# EAGLE board Balanbot-v2.0 (EAGLE 6.6.0)
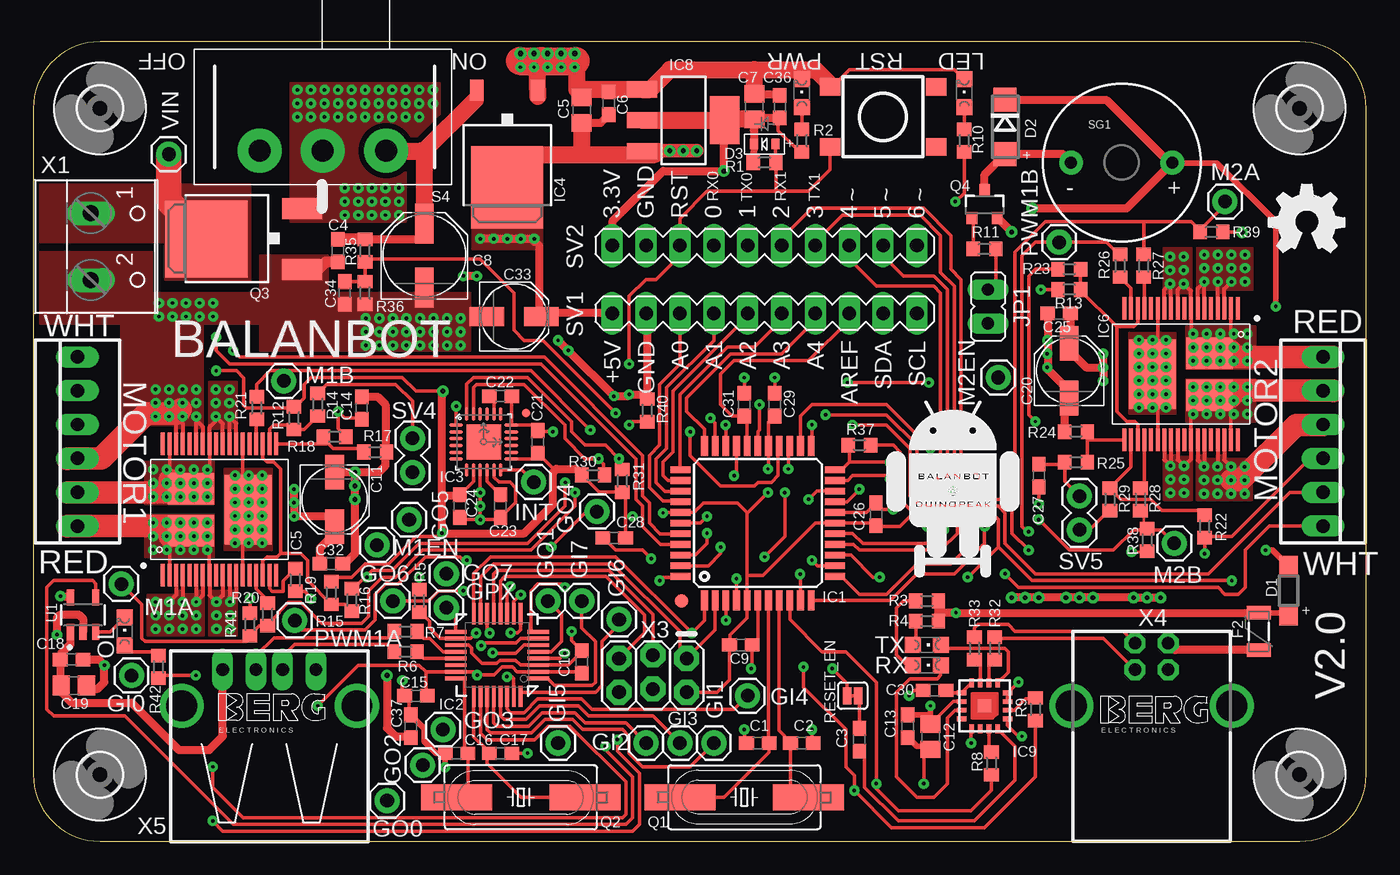
[diagram p2: board, top side]
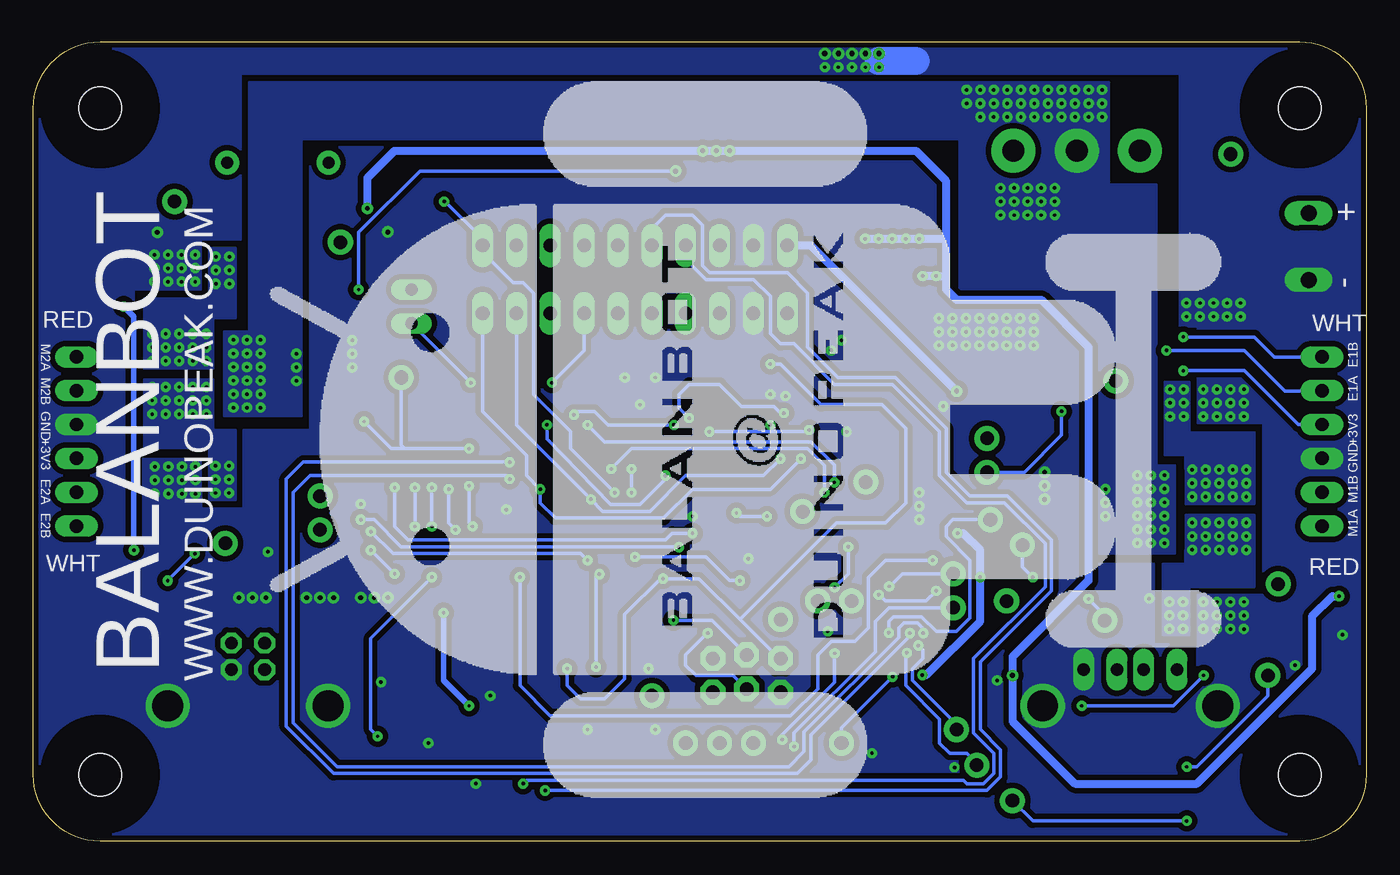
[diagram p3: board, bottom side, seen from below]

Size 100 x 60 mm. Coordinates in mm from the lower left corner, seen from the top.
Outline: 5,0 95,0 arc90 100,5 100,55 arc90 95,60 5,60 arc90 0,55 0,5 arc90 5,0
Copper layers (1*16): Top 0.035mm / dielectric 1.5mm / Bottom 0.035mm
Design rules "Sparkfun *": minimum track width 8mil, minimum drill 8mil, track to track 8mil, track to pad 8mil, pad to pad 8mil, via to via 8mil, smd to smd 8mil, copper to edge 10mil, drill to drill 8mil, minimum pad ring 12mil, minimum via ring 10mil, stop-mask expansion 4mil, vias tented up to drill 25mil, thermal gap 10mil

## Footprints (pad centres in the part's own frame; a part is rotated, then mirrored left to right if it is on the bottom)
C0603 = smd 1.1 x 1: 1 -0.85,0; 2 0.85,0
C0805 = smd 1.3 x 1.5: 1 -0.95,0; 2 0.95,0
PANASONIC_D = smd 3 x 1.4: + 2.4,0; - -2.4,0
PANASONIC_C = smd 2.6 x 1.4: + 2.05,0; - -2.05,0
SOD123 = smd 1.4 x 1.4: A 1.9,0; C -1.9,0
DO214AC = smd 1.8 x 1.7: A 2.05,0; C -2.05,0
SOD-523 = smd 0.8 x 0.6: A 0,-0.8; K 0,0.8
PTC-1206 = smd 1 x 1.8: 1 -1.4,0; 2 1.4,0
1X01 = drill 1.016 pad 1.88: 1 0,0
3,2 = hole 3.2: 0,0
TQFP44 = smd 1.5 x 0.5: 1 -5.8,4; 2 -5.8,3.2; 3 -5.8,2.4; 4 -5.8,1.6; 5 -5.8,0.8; 6 -5.8,0; 7 -5.8,-0.8; 8 -5.8,-1.6; 9 -5.8,-2.4; 10 -5.8,-3.2; 11 -5.8,-4; 23 5.8,-4; 24 5.8,-3.2; 25 5.8,-2.4; 26 5.8,-1.6; 27 5.8,-0.8; 28 5.8,0; 29 5.8,0.8; 30 5.8,1.6; 31 5.8,2.4; 32 5.8,3.2; 33 5.8,4 | smd 0.5 x 1.5: 12 -4,-5.8; 13 -3.2,-5.8; 14 -2.4,-5.8; 15 -1.6,-5.8; 16 -0.8,-5.8; 17 0,-5.8; 18 0.8,-5.8; 19 1.6,-5.8; 20 2.4,-5.8; 21 3.2,-5.8; 22 4,-5.8; 34 4,5.8; 35 3.2,5.8; 36 2.4,5.8; 37 1.6,5.8; 38 0.8,5.8; 39 0,5.8; 40 -0.8,5.8; 41 -1.6,5.8; 42 -2.4,5.8; 43 -3.2,5.8; 44 -4,5.8
TQFP32_8MIL = smd 0.294 x 1.6: 1 -1.75,-3.1; 2 -1.25,-3.1; 3 -0.75,-3.1; 4 -0.25,-3.1; 5 0.25,-3.1; 6 0.75,-3.1; 7 1.25,-3.1; 8 1.75,-3.1; 17 1.75,3.1; 18 1.25,3.1; 19 0.75,3.1; 20 0.25,3.1; 21 -0.25,3.1; 22 -0.75,3.1; 23 -1.25,3.1; 24 -1.75,3.1 | smd 1.6 x 0.294: 9 3.1,-1.75; 10 3.1,-1.25; 11 3.1,-0.75; 12 3.1,-0.25; 13 3.1,0.25; 14 3.1,0.75; 15 3.1,1.25; 16 3.1,1.75; 25 -3.1,1.75; 26 -3.1,1.25; 27 -3.1,0.75; 28 -3.1,0.25; 29 -3.1,-0.25; 30 -3.1,-0.75; 31 -3.1,-1.25; 32 -3.1,-1.75
TESTING_QFN-24-4MM2 = smd 1.016 x 0.254: 1 -2.066,1.257; 2 -2.066,0.75; 3 -2.066,0.247; 4 -2.066,-0.287; 5 -2.066,-0.792; 6 -2.066,-1.297; 13 2.086,-1.297; 14 2.086,-0.792; 15 2.086,-0.287; 16 2.086,0.247; 17 2.086,0.75; 18 2.086,1.257 | smd 0.254 x 1.016: 7 -1.267,-2.122; 8 -0.762,-2.122; 9 -0.258,-2.122; 10 0.278,-2.122; 11 0.78,-2.122; 12 1.287,-2.122; 19 1.287,2.082; 20 0.78,2.082; 21 0.278,2.082; 22 -0.258,2.082; 23 -0.762,2.082; 24 -1.267,2.082 | smd 2.616 x 2.616: P$1 0.02,-0.01
DPACK = smd 1 x 1.6: 1 -2.28,-4.8; 3 2.28,-4.8 | smd 5.4 x 6.2: 2 0,2.5
POWERSSO-36 = smd 1.7 x 0.3: 1 -4.933,4.25; 2 -4.933,3.75; 3 -4.933,3.25; 4 -4.933,2.75; 5 -4.933,2.25; 6 -4.933,1.75; 7 -4.933,1.25; 8 -4.933,0.75; 9 -4.933,0.25; 10 -4.933,-0.25; 11 -4.933,-0.75; 12 -4.933,-1.25; 13 -4.933,-1.75; 14 -4.933,-2.25; 15 -4.933,-2.75; 16 -4.933,-3.25; 17 -4.933,-3.75; 18 -4.933,-4.25; 19 4.933,-4.25; 20 4.933,-3.75; 21 4.933,-3.25; 22 4.933,-2.75; 23 4.933,-2.25; 24 4.933,-1.75; 25 4.933,-1.25; 26 4.933,-0.75; 27 4.933,-0.25; 28 4.933,0.25; 29 4.933,0.75; 30 4.933,1.25; 31 4.933,1.75; 32 4.933,2.25; 33 4.933,2.75; 34 4.933,3.25; 35 4.933,3.75; 36 4.933,4.25 | smd 5.2 x 3.5: S1 0,-2.15 | smd 2.35 x 3.5: S2 -1.575,2.15; S3 1.575,2.15
SOT223 = smd 1.219 x 2.235: 1 -2.311,-3.099; 2 0,-3.099; 3 2.311,-3.099 | smd 3.6 x 2.2: 4 0,3.099
QFN16 = smd 0.7 x 0.35: 1 -1.725,0.975; 2 -1.725,0.325; 3 -1.725,-0.325; 4 -1.725,-0.975; 9 1.725,-0.975; 10 1.725,-0.325; 11 1.725,0.325; 12 1.725,0.975 | smd 0.35 x 0.7: 5 -0.975,-1.725; 6 -0.325,-1.725; 7 0.325,-1.725; 8 0.975,-1.725; 13 0.975,1.725; 14 0.325,1.725; 15 -0.325,1.725; 16 -0.975,1.725 | smd 1 x 1: TAB 0,0
JP1 = drill 0.914 long: 1 0,-1.27; 2 0,1.27
MICRO-FIDUCIAL = smd 0.635 x 0.635: 1 0,0
FIDUCIAL-1X2 = smd 1 x 1: 1 0,0
CHIPLED_0805 = smd 1.2 x 1.2: A 0,-1.05; C 0,1.05
22-23-2061 = drill 1 long: 1 -6.35,0; 2 -3.81,0; 3 -1.27,0; 4 1.27,0; 5 3.81,0; 6 6.35,0
HC49UP = smd 5.334 x 1.93: 1 -4.826,0; 2 4.826,0
DPAK = smd 1.6 x 3: 1 -2.285,-7.18; 3 2.285,-7.18 | smd 5.8 x 6.2: 4 0,0
SOT23-3 = smd 0.8 x 0.9: 1 -0.95,-1; 2 0.95,-1; 3 0,1.1
R0603 = smd 1 x 1.1: 1 -0.85,0; 2 0.85,0
SJ_2S = smd 0.635 x 1.27: 1 -0.412,0; 2 0.412,0
TACTILE_SWITCH_TALL = smd 1.55 x 1.3: A1 -3.975,-2.25; A2 3.975,-2.25; B1 -3.975,2.25; B2 3.975,2.25
SWITCH-SPDT = drill 1.651 pad 3.302: 1 -2.54,-4.623; 2 -2.54,0.127; 3 -2.54,4.877
BUZZER-12MM = drill 0.9 pad 1.778: + 3.8,0; - -3.8,0
MA10-1 = drill 1.016 long: 1 -10.16,0; 2 -7.62,0; 3 -5.08,0; 4 -2.54,0; 5 0,0; 6 2.54,0; 7 5.08,0; 8 7.62,0; 9 10.16,0; 10 12.7,0
1X02 = drill 1.016 pad 1.88: 1 0,0; 2 2.54,0
SOT23-5 = smd 0.55 x 1.2: 1 -0.95,-1.3; 2 0,-1.3; 3 0.95,-1.3; 4 0.95,1.3; 5 -0.95,1.3
W237-102 = drill 1.194 long: 1 -2.5,-1.27; 2 2.5,-1.27
2X3_LOCK = drill 1.016 pad 1.88 octagon: 1 0,0; 2 0,2.54; 3 2.54,-0.254; 4 2.54,2.286; 5 5.08,0; 6 5.08,2.54
PN61729-S = drill 0.95 octagon: 1 1.25,4.71; 2 -1.25,4.71; 3 -1.25,2.71; 4 1.25,2.71 | drill 2.3 pad 2.9: S1 -6.02,0; S2 6.02,0
PN87520-S = drill 0.95 long: 1 -3.5,2.71; 2 -1,2.71; 3 1,2.71; 4 3.5,2.71 | drill 2.3 pad 2.9: S1 -6.57,0; S2 6.57,0

## Placement (x,y rotation side)
C1  18pF  [C0603]  54.36,7.37 0 top
C2  18pF  [C0603]  57.66,7.37 0 top
C3  100nF  [C0603]  61.98,7.62 90 top
C4  100nF/16V  [C0603]  22.86,44.32 90 top
C5  10uF  [C0805]  41.15,54.86 90 top
C6  100nF  [C0603]  43.18,55.37 270 top
C7  10uF  [C0805]  54.1,55.12 90 top
C8  100uF/16V  [PANASONIC_D]  29.34,43.94 90 top
C9  100nF  [C0603]  53.09,14.73 180 top
C10  100nF  [C0603]  41.15,13.46 90 top
C11  47uF/16V  [PANASONIC_C]  22.61,25.65 270 top
C12  4.7uF  [C0805]  67.31,7.85 270 top
C13  100nF  [C0603]  65.61,8.64 90 top
C14  33nF  [C0603]  24.64,32.51 90 top
C15  100nF  [C0603]  28.7,10.92 180 top
C16  18pF  [C0603]  31.75,6.6 0 top
C17  18pF  [C0603]  35.05,6.6 180 top
C18  100nF  [C0603]  2.87,13.64 0 top
C19  4.7uF  [C0805]  3.05,11.68 0 top
C20  47uF/16V  [PANASONIC_C]  77.72,35.31 90 top
C21  100nF  [C0603]  37.85,29.97 90 top
C22  2.2nF  [C0603]  35.05,33.4 0 top
C23  100nF  [C0603]  35.05,25.15 90 top
C24  10nF  [C0603]  32,25.15 90 top
C25  100nF  [C0603]  76.96,39.62 180 top
C26  100nF  [C0603]  63.22,24.54 270 top
C27  33nF  [C0603]  75.44,27.43 270 top
C28  100nF  [C0603]  43.59,22.76 0 top
C29  100nF  [C0603]  55.63,32.77 270 top
C30  100nF  [C0603]  67.61,11.33 0 top
C31  100nF  [C0603]  53.34,32.77 270 top
C32  100nF  [C0603]  22.35,20.83 0 top
C33  47uF/16V  [PANASONIC_C]  36.07,39.37 0 top
C34  100nF  [C0603]  23.37,41.15 90 top
C36  100nF  [C0603]  56.01,55.12 270 top
C37  100nF  [C0603]  28.32,8.64 90 top
D1  PMEG2010-ER  [SOD123]  94.18,18.8 270 top
D2  S1M-13-F  [DO214AC]  72.9,53.59 270 top
D3  1N4148  [SOD-523]  54.86,52.32 90 top
F2  PTC_500mA  [PTC-1206]  91.95,15.75 90 top
GI0  M01PTH  [1X01]  7.37,12.45 0 top
GI1  M01PTH  [1X01]  51.05,7.37 90 top
GI2  M01PTH  [1X01]  45.97,7.37 90 top
GI3  M01PTH  [1X01]  48.51,7.37 90 top
GI4  M01PTH  [1X01]  53.59,10.92 90 top
GI5  M01PTH  [1X01]  39.37,7.37 90 top
GI6  M01PTH  [1X01]  43.94,16.64 90 top
GI7  M01PTH  [1X01]  41.15,18.03 90 top
GO0  M01PTH  [1X01]  26.54,3.05 0 top
GO1  M01PTH  [1X01]  38.61,18.03 90 top
GO2  M01PTH  [1X01]  29.21,5.71 90 top
GO3  M01PTH  [1X01]  30.73,8.38 90 top
GO4  M01PTH  [1X01]  42.29,24.74 90 top
GO5  M01PTH  [1X01]  28.19,24.13 90 top
GO6  M01PTH  [1X01]  26.97,18.03 90 top
GO7  M01PTH  [1X01]  30.99,20.07 90 top
GPX  M01PTH  [1X01]  30.99,17.53 0 top
H1  MOUNT-HOLE3.2  [3,2]  5,5 0 top
H2  MOUNT-HOLE3.2  [3,2]  95,5 0 top
H3  MOUNT-HOLE3.2  [3,2]  5,55 0 top
H4  MOUNT-HOLE3.2  [3,2]  95,55 0 top
IC1  ATMEGA1284PA  [TQFP44]  54.36,23.88 90 top
IC2  MAX3421E  [TQFP32_8MIL]  34.8,13.97 90 top
IC3  MPU-6050  [TESTING_QFN-24-4MM2]  33.78,29.97 0 top
IC4  MC33269D-5.0  [DPACK]  35.56,51.56 180 top
IC5  VNH5180ATR-E  [POWERSSO-36]  13.97,24.89 90 top
IC6  VNH5180ATR-E  [POWERSSO-36]  86.11,35.05 270 top
IC8  LD1117-3V3  [SOT223]  48.77,54.1 270 top
IC9  FT230XQ  [QFN16]  71.37,10.16 180 top
INT  M01PTH  [1X01]  37.54,26.95 0 top
JP1  [JP1]  71.63,40.13 0 top
JP2  FIDUCIALUFIDUCIAL  [MICRO-FIDUCIAL]  36.96,32.13 0 top
JP3  FIDUCIAL1X2  [FIDUCIAL-1X2]  48.64,18.03 0 top
LED  Yellow  [CHIPLED_0805]  69.85,56.13 0 top
LOGO2  OSHW_LOGO_FILLX0200-NT  [OSHW_FILLX200_NOTEXT]  92.71,44.2 0 top
M1A  M01PTH  [1X01]  6.6,19.3 0 top
M1B  M01PTH  [1X01]  18.8,34.54 0 top
M1EN  M01PTH  [1X01]  25.78,22.23 0 top
M2A  M01PTH  [1X01]  89.41,48.01 0 top
M2B  M01PTH  [1X01]  85.6,22.35 270 top
M2EN  M01PTH  [1X01]  72.39,34.8 0 top
MOTOR1  1744037-6(SEE-PICTURE)  [22-23-2061]  3.3,30 90 top
MOTOR2  1744037-6(SEE-PICTURE)  [22-23-2061]  96.77,30 270 top
OL  Red  [CHIPLED_0805]  6.86,15.75 0 top
PWM1A  M01PTH  [1X01]  19.61,16.56 0 top
PWM1B  M01PTH  [1X01]  76.96,44.96 0 top
PWR  Green  [CHIPLED_0805]  57.66,56.13 0 top
Q1  10MHz  [HC49UP]  53.34,3.3 180 top
Q2  12MHz  [HC49UP]  36.58,3.3 0 top
Q3  DMP3025  [DPAK]  12.98,45.19 90 top
Q4  [SOT23-3]  71.37,47.75 0 top
R1  10K  [R0603]  54.86,50.93 180 top
R2  270R  [R0603]  57.66,52.58 270 top
R3  560R  [R0603]  67.06,18.03 0 top
R4  560R  [R0603]  67.06,16.51 0 top
R5  2.2K  [R0603]  28.96,18.03 90 top
R6  33/1%  [R0603]  27.94,14.22 0 top
R7  33/1%  [R0603]  27.94,15.75 0 top
R8  1K  [R0603]  71.88,5.84 90 top
R9  1K  [R0603]  75.18,9.91 90 top
R10  1K  [R0603]  69.85,52.58 270 top
R11  1K  [R0603]  71.37,44.45 180 top
R12  10K  [R0603]  19.56,31.75 90 top
R13  10K  [R0603]  77.72,41.4 180 top
R14  1K  [R0603]  21.34,32.77 270 top
R15  10K  [R0603]  22.35,18.62 90 top
R16  1K  [R0603]  23.9,18.11 90 top
R17  1K5  [R0603]  25.65,29.21 180 top
R18  10K  [R0603]  22.61,30.35 180 top
R19  1K  [R0603]  19.66,19.61 270 top
R20  1K  [R0603]  17.58,17.02 270 top
R21  1K  [R0603]  16.76,32.51 90 top
R22  10K  [R0603]  87.88,23.62 270 top
R23  1K  [R0603]  77.72,42.93 180 top
R24  1K5  [R0603]  78.23,30.73 0 top
R25  10K  [R0603]  78.23,28.45 0 top
R26  1K  [R0603]  81.53,43.18 90 top
R27  1K  [R0603]  83.31,43.18 90 top
R28  1K  [R0603]  83.06,25.65 270 top
R29  1K  [R0603]  80.77,25.65 90 top
R30  10K  [R0603]  42.01,27.48 180 top
R31  10K  [R0603]  44.2,27.05 270 top
R32  27  [R0603]  72.14,14.48 270 top
R33  27  [R0603]  70.61,14.48 270 top
R35  47K  [R0603]  24.89,44.32 90 top
R36  12K  [R0603]  24.89,41.15 90 top
R37  10K  [R0603]  61.98,29.72 180 top
R38  10K  [R0603]  83.57,22.61 90 top
R39  10K  [R0603]  88.39,45.72 180 top
R40  10K  [R0603]  46.05,32.33 270 top
R41  10K  [R0603]  16.26,16.26 270 top
R42  270R  [R0603]  9.4,13.08 270 top
RESET_EN  SOLDERJUMPERNC  [SJ_2S]  61.47,10.92 180 top
RX  YELLOW  [CHIPLED_0805]  67.06,13.21 270 top
S1  DTSM-62K-S-V-T/R(SN431)  [TACTILE_SWITCH_TALL]  63.75,54.36 180 top
S4  [SWITCH-SPDT]  21.84,54.36 90 top
SG1  BUZZERPTH  [BUZZER-12MM]  81.66,50.93 0 top
SV1  [MA10-1]  53.59,39.62 0 top
SV2  [MA10-1]  53.59,44.7 0 top
SV3  VIN  [1X01]  10.16,51.56 0 top
SV4  [1X02]  28.45,27.69 90 top
SV5  [1X02]  78.49,25.91 270 top
TX  YELLOW  [CHIPLED_0805]  67.06,14.73 270 top
U1  NCP380HSN05AAT1G  [SOT23-5]  3.73,16.99 0 top
U$2  [DUINOPEAK-ANDROID-LOGO-0.65]  64.01,19.81 0 top
U$3  [DUINOPEAK-ANDROID-LOGO-3.5]  10.92,3.3 90 bottom
X1  [W237-102]  5.59,44.62 270 top
X3  AVR_SPI_PRG_62X3_LOCK  [2X3_LOCK]  49.02,13.72 180 top
X4  PN61729-S  [PN61729-S]  83.9,10.16 0 top
X5  PN87520-S  [PN87520-S]  17.7,10.16 0 top

## Tracks (layer width: path | path; a pad name or v marks a point on that pad's centre or on a via)
+3V3  (via drill 0.25, 0.36)
  Top 0.254: 52.25,14.73 52.27,14.76 52.27,15.47 53.56,16.75 IC1.5 53.56,19.95 | 52.25,14.73 52.32,14.73 52.32,14.99 | 52.25,14.73 C9.2 52.24,12.1 51.31,11.18 X3.2 | C29.2 55.16,31.45 IC1.27 55.16,27.98 v55.12,27.94 | IC3.13 37.4,28.68 C21.1 39.12,27.85 39.24,27.94 | IC3.8 33.02,27 32.03,26.01 32.03,25.93 32,25.91 C24.2 | v13.72,35.31 15.24,35.31 15.8,34.75 15.8,32.72 16,32.51 19.47,32.51 R12.2 19.65,32.6 | MOTOR2.4 95.79,28.73 89.92,22.86 87.88,22.86 R22.2 v87.88,21.59 | IC2.23 | 53.56,19.95 53.56,24.65 | 53.56,24.65 53.58,24.65 | 53.58,24.65 53.59,24.64 v55.12,26.16 | 53.56,24.65 53.56,24.68 | v75.59,41.4 R13.2 | 72.39,22.1 72.39,24.13 71.88,24.64 66.04,24.64 | 66.04,24.64 65.02,23.62 63.16,23.62 | 53.56,19.95 54.75,19.95 58.67,23.88 IC1.17 63.03,23.88 C26.2 63.16,23.62 | 30.66,33.78 28.7,33.78 27.69,34.8 20.83,34.8 20.32,34.29 20.32,33.27 19.65,32.6 | 30.66,33.78 30.66,33.71 30.65,33.7 | R2.2 57.24,51.73 57.24,51.98 55.88,53.34 55.88,54.36 | 53.56,24.68 52.83,25.4 50.29,25.4 49.57,24.68 IC1.38 47.28,24.68 v47.24,24.64 | 53.56,24.68 53.58,24.65 | IC9.1 73.1,8.69 73.91,7.87 v74.17,7.87 | v70.1,19.81 72.39,22.1 | R37.1 64.52,29.72 65.02,29.21 65.02,25.65 66.04,24.64 | C10.1 41.04,12.72 IC2.2 36.3,12.72 35.94,13.08 35.18,13.08 34.57,12.47 v33.3,12.47 33.05,12.72 IC2.23 | R5.2 v28.96,19.81 | v21.34,10.16 24.38,13.21 28.96,13.21 29.46,12.7 | 29.46,12.7 31.5,12.7 31.52,12.72 IC2.23 | 29.46,12.7 29.46,11.34 29.55,11.25 C15.1 | 62.9,23.62 63.16,23.62 | v30.73,33.78 30.66,33.78 | 19.65,32.6 19.56,32.51 | R15.2 22.34,19.47 22.3,19.51 22.61,19.81 23.88,19.81 24.89,20.83 26.67,20.83 28.7,22.86 30.48,22.86 30.73,23.11
  Top 0.254: v12.19,12.45 9.4,12.45 R42.2 | 54.1,54.1 54.1,54.05 54.06,54.01 | C7.1 54.1,54.1 | 54.1,54.1 54.29,54.1 54.46,54.27 | C28.2 44.44,24.38 | 44.44,24.38 44.44,25.92 44.2,26.16 R31.2 42.44,26.2 R30.2 | v44.96,24.38 44.44,24.38 | 72.39,22.1 74.93,19.56 v89.92,19.56
  Top 0.406: 56.13,54.1 56.13,54.27 C36.2 56.01,54.36 55.88,54.36
  Top 0.508: D3.K 54.03,51.31 54.03,50.66 R1.2 | 54.01,53.34 54.06,52.83 54.06,53.59 | IC8.4 52.07,54.1 52.07,54.36
  Top 0.61: 51.82,54.15 v51.82,50.29 47.24,50.29 43.43,46.48 SV2.1 | 30.65,25.91 v30.65,23.12 v30.66,23.11 | v30.66,23.11 30.73,23.11 36.83,23.11 38.99,25.27 38.99,27.69 39.24,27.94 40.7,27.94 R30.2 | 32,25.91 30.65,25.91 | v30.66,23.11 30.66,23.04 | 30.65,25.91 30.65,33.7 | C36.2 54.46,54.27 | 52.26,54.17 52.07,54.36 | 54.01,54.01 54.06,54.01 54.06,53.59 D3.K
  Top 1.27: IC8.2 IC8.4 51.82,54.15 | 51.82,54.15 | C7.1 52.26,54.17
  Bottom 0.254: MOTOR1.4 5.11,31.27 9.14,35.31 v13.72,35.31 | v55.12,27.94 v55.12,26.16 | v51.82,50.29 70.99,50.29 75.59,45.69 v75.59,41.4 | v74.17,7.87 74.68,8.38 74.68,15.24 v70.1,19.81 | v21.34,10.16 14.48,10.16 v12.19,12.45 | v44.96,24.38 46.99,24.38 v47.24,24.64 | v87.88,21.59 v89.92,19.56
  Bottom 0.61: v30.73,33.78 41.66,44.7 SV2.1 | v30.66,23.11 30.23,23.11 28.96,21.84 v28.96,19.81 28.96,16.51 32.99,12.47 v33.3,12.47
+5V  (via drill 0.25, 0.36)
  Top 0.254: 2.69,18.39 U1.5 | U1.5 | U1.5
  Top 0.406: v93.22,40.13 93.22,46.48 88.8,50.9 85.46,50.9 SG1.+ | 46.63,51.54 46,51.54 45.72,51.82 | IC8.3 45.24,51.79 45.21,51.82 | 37.95,44.65 37.95,44.86 v37.59,45.21 | D1.C 94.11,20.7 92.96,21.84 v92.46,21.84
  Top 0.61: v33.27,42.42 v32.26,42.42 | C5.1 42.57,53.91 C6.2 | v33.53,45.21 v34.54,45.21 v35.56,45.21 v36.58,45.21 v37.59,45.21 37.59,44.98 | v2.03,18.39 2.69,18.39 | 37.95,44.65 37.95,39.27 37.86,39.27 C33.+ 37.85,39.37 37.85,39.62 SV1.1 | D2.C 80.5,55.64 85.22,50.93 | 85.22,50.93 85.16,50.93 | v74.93,47.5 82.04,47.5 85.34,50.8 85.34,50.81 SG1.+ 85.22,50.93 | v26.54,12.45 26.54,8.51 27.18,7.87 28.23,7.87 C37.1
  Top 1.016: v49.78,51.82 45.72,51.82 45.21,51.82 44.96,51.82
  Top 1.27: 35.31,51.03 35.74,51.46 35.61,51.46 35.53,51.54 40.89,51.54 | 40.89,51.54 46.63,51.54 46.86,51.77 | C5.1 41.15,51.79 40.89,51.54
  Bottom 0.406: v93.22,40.13 92.46,39.37 v92.46,21.84
  Bottom 0.61: v74.93,47.5 74.93,49.78 72.9,51.82 v49.78,51.82 v48.77,51.82 v47.75,51.82 33.78,51.82 31.5,49.53 31.5,45.21 | 31.5,42.42 31.5,41.4 30.73,40.64 24.38,40.64 20.83,37.08 20.83,19.56 26.54,13.84 v26.54,12.45 26.54,9.02 21.84,4.32 12.7,4.32 4.06,12.95 4.06,16.86 2.54,18.39 v2.04,18.39 v2.03,18.39 | 31.5,42.42 31.5,45.21 | 31.5,42.42 v32.26,42.42 v33.27,42.42 | v37.59,45.21 31.5,45.21
  pour Top (no thermals): 32.97,46.74 38.15,46.74 38.15,44.45 32.97,44.45
A0
  Top 0.254: SV1.3 48.51,35.81 46.99,34.29 46.99,29.72 46.23,28.96 46.23,26.54 47.24,25.53 48.51,25.53 IC1.37
A1
  Top 0.254: IC1.36 48.54,26.26 47.4,26.26 46.74,26.92 46.74,28.7 47.5,29.46 47.5,34.04 51.05,37.59 SV1.4
A2
  Top 0.254: SV1.5 53.59,39.37 48.01,33.78 48.01,29.21 47.24,28.45 47.24,27.43 47.6,27.08 IC1.35
A3
  Top 0.254: IC1.34 48.56,27.9 48.51,27.94 48.51,33.53 52.07,37.08 54.1,37.08 56.13,39.12 SV1.6
A4/BUZZER  (via drill 0.25)
  Top 0.254: IC1.33 50.36,30.92 49.02,32.26 49.02,33.27 52.32,36.58 56.13,36.58 58.67,39.12 SV1.7 | v61.09,34.42 v67.18,34.42
  Bottom 0.254: SV1.7 58.67,36.83 v61.09,34.42 | v67.18,34.42 JP1.1
AREF
  Top 0.254: IC1.29 53.56,31.7 C31.2 52.41,31.92 51.56,32.77 51.56,35.05 52.58,36.07 58.17,36.07 61.21,39.12 SV1.8
EN1A  (via drill 0.25)
  Top 0.254: v14.99,36.83 15.49,36.32 38.35,36.32 45.72,28.96 45.72,25.91 46.23,25.4 46.23,23.88 47.03,23.08 IC1.40
  Bottom 0.254: v14.99,36.83 9.14,36.83 6.1,33.78 3.3,33.78 MOTOR1.5
EN1B  (via drill 0.25)
  Top 0.254: v13.72,37.85 13.72,36.83 14.73,35.81 38.1,35.81 45.21,28.7 45.21,25.65 45.72,25.15 45.72,23.62 47.07,22.28 IC1.41
  Bottom 0.254: MOTOR1.6 6.89,36.35 8.38,37.85 v13.72,37.85
EN2A  (via drill 0.25)
  Top 0.254: v59.44,32 64.01,32 66.29,29.72 66.29,26.16 66.8,25.65 72.9,25.65 73.41,25.15 73.41,23.11 v74.68,21.84 | IC1.31 51.96,30.87 v51.94,31.24 | v72.9,20.07 73.91,19.05 88.9,19.05 89.41,18.54 90.42,18.54 90.93,19.05 90.93,21.84 92.74,23.65 MOTOR2.6
  Bottom 0.254: v51.94,31.24 56.9,31.24 57.91,32.26 59.18,32.26 v59.44,32 | v74.68,21.84 v72.9,20.07
EN2B  (via drill 0.25)
  Top 0.254: IC1.30 52.76,27.61 v52.58,27.43 | v61.47,31.24 64.01,31.24 65.79,29.46 65.79,25.91 66.55,25.15 72.39,25.15 72.9,24.64 72.9,22.35 75.18,20.07 88.14,20.07 94.26,26.19 MOTOR2.5
  Bottom 0.254: v52.58,27.43 52.58,27.18 54.48,25.27 56.69,25.27 61.47,30.18 v61.47,31.24
GND  (via drill 0.25, 0.36, 0.4)
  Top 0.203: v82.4,21.72 83.53,21.72 R38.1
  Top 0.254: IC2.19 32.65,14.72 32.87,14.5 32.87,14.12 33.66,13.34 34.75,13.34 35,13.59 36.19,13.59 36.56,13.22 IC2.3 40.14,13.22 41.15,14.22 C10.2 | IC1.6 54.36,15.15 C9.1 53.94,13.04 v53.85,12.95 | v75.44,25.3 C27.2 | IC3.9 33.52,24.3 33.53,24.3 v33.53,24.13 | v33.53,24.13 32,24.13 C24.1 32,24.38 | v33.53,24.13 34.8,24.13 35.05,24.38 C23.1 36.19,25.44 36.19,26.52 35.76,26.95 34.93,26.95 34.56,27.31 IC3.11 | C31.1 v53.34,34.8 | C29.1 v55.63,34.8 | 59.94,24.64 59.98,24.68 IC1.18 62.52,24.68 63.22,25.37 C26.1 63.72,24.89 v64.52,24.89 | IC3.1 31.72,32.55 v31.72,32.64 | LED.C 69.82,57.18 69.09,57.91 61.21,57.91 59.94,56.64 59.81,56.64 S1.A2 | Q4.2 72.37,46.75 | IC1.39 50.04,23.88 v50.55,24.38 | v27.69,12.06 27.69,11.18 | 27.69,11.18 27.43,11.18 | IC9.3 IC9.4 73.11,11.14 v73.91,11.94 | C13.1 65.87,7.79 | C30.1 66.12,11.33 v65.71,10.92 | v66.8,4.32 66.8,6.39 C12.2 67.1,7.11 66.67,7.11 | v70.36,7.37 70.36,8.38 70.4,8.42 IC9.13 | Q3.1 21.36,42.9 | v90.7,45.69 89.27,45.69 R39.1 | v16.28,18.21 16.28,17.25 16.38,17.15 | 16.38,17.15 16.51,17.02 | 36.5,58.55 36.5,58.14 v36.55,58.09 | v40.61,58.09 40.56,58.09 40.51,58.04 | 28.19,11.18 28.19,10.92 | 28.19,10.92 28.19,9.99 28.32,9.87 C37.2 | C10.2 41.15,14.48 | C17.1 v37.08,6.6 | v40.39,15.75 40.39,15.07 C10.2 | IC1.28 54.36,30.73 54.48,30.86 v54.48,32.77 | v53.34,8.38 53.34,7.62 53.59,7.37 C1.1 53.34,7.37 | v58.42,8.38 58.42,7.45 C2.2 | C15.2 27.85,11.01 | 27.85,11.01 27.69,11.18 | v38.99,30.73 37.93,30.73 C21.2 37.44,31.23 IC3.18 35.87,33.75 35.9,33.53 C22.2 | R41.1 16.34,17.11 16.38,17.15 | 27.85,11.01 28.11,11.01 28.19,10.92 | 55.88,55.88 55.92,55.88 C36.1 | C28.1 42.9,22.63 43.69,21.84 45.72,21.84 v46.36,21.21
  Top 0.305: IC5.34 10.72,31.45 10.19,31.45 v10.19,31.88 | IC5.33 11.23,31.32 11.2,31.32 v11.2,31.88 | IC5.31 12.22,31.6 | IC5.30 12.73,31.09 12.22,31.6 | 12.22,31.6 v12.22,31.88 | IC5.3 10.72,18.49 v10.19,17.96 | IC5.4 11.22,17.98 v11.2,17.96 | IC5.6 v12.22,17.96 12.72,18.46 IC5.7 | IC6.34 89.36,28.63 v89.87,28.12 | IC6.33 v88.86,28.12 v88.85,28.12 | IC6.31 87.86,28.14 v87.83,28.12 87.36,28.59 IC6.30 | IC6.3 89.36,41.45 v89.89,41.99 | IC6.4 88.86,41.97 v88.87,41.99 | IC6.6 v87.86,41.98 v87.86,41.99 87.36,41.48 IC6.7
  Top 0.406: 43.14,56.26 C6.1 42.99,56.41 41.15,56.41 | 66.67,7.11 66.28,7.11 C13.1 | C37.2 29.34,8.47 29.34,7.49 30.23,6.6 C16.1 30.99,6.6 30.89,6.5 v30.89,5.54
  Top 0.61: C14.2 25.82,33.36 26.42,32.77 26.42,29.3 R17.1 26.42,29.12 26.42,28.19 25.93,27.7 24,27.7 | 82.8,18.29 v82.55,18.29 | v82.55,18.29 v79.5,18.29 | v79.5,18.29 v78.49,18.29 v77.47,18.29 | v82.55,18.29 v84.58,18.29 | v39.37,37.59 v40.13,36.83 v43.56,33.4 44.58,33.4 v44.7,33.53 46.05,33.53 | 72.37,46.75 v73.41,45.72 | v79.5,18.29 v75.44,18.29 v74.42,18.29 v73.41,18.29 | U1.2 3.73,16.69 3.4,17.02 2.03,17.02 1.78,16.76 v1.78,15.49 | 3.77,11.45 4.85,11.45 5.33,11.94 v5.33,13.21 4.9,13.64 C18.2 | C7.2 55.69,56.07 55.88,55.88 | PWR.C 57.66,57.91 | 3.72,11.45 3.77,11.45 | 3.77,11.45 C19.2 | C32.2 23.37,20.83 24.13,21.59 v24.13,25.65 v24.13,26.67 24.13,27.58 24,27.7 | SV1.2 46.05,39.62 46.05,33.53 | 46.05,33.53 R40.1 | C11.- 24,27.7 | R24.1 77.38,32.91 C20.- 77.47,33.51 77.47,34.04 76.11,35.39 76.11,35.56 | C25.2 76.11,35.56 | v76.07,35.56 76.11,35.56
  Top 0.813: C4.1 21.93,43.47 21.36,42.9
  Top 1.27: 41.15,56.41 IC8.1 46.25,56.41 47.75,57.91 54.1,57.91 | 41.15,56.41 40.79,56.41 40.79,57.76 40.51,58.04 40.39,58.17 | 54.1,57.91 57.66,57.91 58.67,57.91 59.94,56.64 | C7.2 54.1,57.91 | 38.1,58.55 37.84,58.29 IC4.1 37.84,55.89 37.85,55.88 | C5.2 41.15,56.41
  Top 1.676: 11.05,32.39 10.74,32.08 8.46,32.08 5.11,28.73 MOTOR1.3 2.57,28.73 2.54,28.7 | v89.87,27.1 90.6,27.1 94.74,31.24 96.77,31.24
  Top 2.083: 36.5,58.55 38.1,58.55 40.72,58.55
  Bottom 2.083: 33.78,58.55 36.58,58.55
  other vias: 10.19,16.94 10.19,15.93 11.2,16.94 11.2,15.93 12.22,15.93 12.22,16.94 12.22,32.89 11.2,32.89 10.19,32.89 12.22,33.91 11.2,33.91 10.19,33.91 30.02,37.21 30.02,38.23 31.04,38.23 29.01,37.21 31.04,37.21 32.05,38.23 32.05,37.21 25.96,38.23 25.96,37.21 26.97,37.21 27.99,37.21 27.99,38.23 26.97,38.23 24.94,37.21 24.94,38.23 87.83,27.1 87.83,26.09 88.85,26.09 89.87,26.09 88.85,27.1 89.89,43 89.89,44.02 88.87,43 88.87,44.02 87.86,43 90.88,28.12 90.88,27.1 90.88,26.09 90.91,44.02 90.91,43 90.91,41.99 9.17,33.91 9.17,32.89 9.17,31.88 9.17,17.96 9.17,16.94 9.17,15.93 11.46,40.39 10.44,39.37 10.44,40.39 12.47,39.37 11.46,39.37 12.47,40.39 33.53,25.15 33.53,26.16 38.58,58.09 38.58,59.11 36.55,59.11 37.57,59.11 83.57,18.29 87.86,44.02 24.94,39.24 25.96,39.24 26.97,39.24 27.99,39.24 30.02,39.24 31.04,39.24 32.05,39.24 39.6,59.11 40.61,59.11 13.49,40.39 13.49,39.37 9.42,39.37 9.42,40.39 37.57,58.09 39.6,58.09 29.01,38.23 24.13,27.69 76.07,37.59 76.07,36.58 29.01,39.24
  pour Top (no thermals): 10.67,31.01 10.67,31.24 6.6,31.24 6.6,39.37 12.7,39.37 12.7,31.01 12.17,31.01 12.17,31.24 11.28,31.24 11.28,31.01
  pour Top (no thermals): 12.78,18.77 12.78,15.44 8.59,15.44 8.59,18.49 10.67,18.49 10.67,18.77 11.28,18.77 11.28,18.54 12.17,18.54 12.17,18.77
  pour Top (no thermals): 0.51,44.2 8.89,44.2 8.89,41.15 32.77,41.15 32.77,36.83 17.02,36.83 17.02,38.86 0.53,38.86
  pour Top (no thermals): 89.41,28.93 89.41,28.7 91.41,28.7 91.41,25.6 87.3,25.6 87.3,28.93 87.91,28.93 87.91,28.7 88.8,28.7 88.8,28.93
  pour Top (no thermals): 87.33,41.17 87.33,44.5 91.47,44.5 91.47,41.4 89.41,41.4 89.41,41.17 88.82,41.17 88.82,41.4 87.91,41.4 87.91,41.17
  pour Bottom (isolate 0.406, no thermals): 35.56,60 100,60 100,0 0,0 0,60 35.05,60 35.05,57.58 13.97,57.58 13.97,38.61 12.65,38.61 12.65,31.37 7.72,31.34 7.72,18.49 12.65,18.49 12.7,2.51 87.22,2.51 87.45,28.7 92.46,28.7 92.46,41.4 87.43,41.4 87.43,45.16 84.43,45.16 84.43,57.58 35.56,57.58
  pour Bottom (isolate 0.406, no thermals): 32,52.07 79.25,52.07 79.25,30.86 84.2,30.86 84.2,24.97 87.63,24.97 87.63,2.29 12.45,2.29 12.45,14.78 15.93,14.78 15.93,20.83 21.34,20.83 21.34,36.83 24.64,40.13 30.99,40.13 32,41.15
  pour Top (no thermals): 17.02,40.64 17.02,43.94 22.1,43.94 22.1,40.64
GPIN0  (via drill 0.25)
  Top 0.254: v13.46,5.59 13.46,4.06 15.75,1.78 44.2,1.78 44.45,2.03 44.45,4.44 40.26,8.64 38.61,8.64 37.59,7.62 34.04,7.62 33.55,8.11 IC2.26
  Bottom 0.254: v13.46,5.59 12.7,5.59 7.37,10.92 GI0.1
GPIN1
  Top 0.254: IC2.27 34.05,8.37 34.29,8.13 37.39,8.13 38.4,9.14 40.46,9.14 41.22,8.38 44.2,8.38 44.7,7.87 44.7,6.6 45.72,5.59 49.28,5.59 GI1.1
GPIN2
  Top 0.254: IC2.28 34.55,8.89 34.8,8.64 37.16,8.64 38.18,9.65 40.64,9.65 41.4,8.89 44.45,8.89 GI2.1
GPIN3
  Top 0.254: IC2.29 35.05,9.4 35.31,9.14 36.98,9.14 38,10.16 40.89,10.16 41.66,9.4 46.48,9.4 GI3.1
GPIN4
  Top 0.254: IC2.30 35.55,9.92 35.81,9.65 36.83,9.65 37.85,10.67 41.15,10.67 41.91,9.91 52.58,9.91 GI4.1
GPIN5  (via drill 0.25)
  Top 0.254: IC2.31 36.05,12.21 35.92,12.34 v35.53,12.34
  Bottom 0.254: GI5.1 39.37,8.51 v35.53,12.34
GPIN6
  Top 0.254: IC2.32 36.55,11.15 36.58,11.18 42.16,11.18 42.67,11.68 42.67,14.99 43.94,16.26 GI6.1
GPIN7
  Top 0.254: IC2.1 38.58,12.22 39.12,11.68 41.91,11.68 42.16,11.94 42.16,14.99 41.15,16 GI7.1
GPOUT0  (via drill 0.25)
  Top 0.254: 37.85,13.72 IC2.4 39.5,13.72 v39.88,14.1 | v43.81,7.62 43.81,6.73 45.47,5.08 45.47,1.27 44.96,0.76 14.22,0.76 v13.46,1.52
  Bottom 0.254: v39.88,14.1 39.88,11.94 43.81,8 v43.81,7.62 | v13.46,1.52 25.02,1.52 GO0.1
GPOUT1
  Top 0.254: IC2.5 38.86,14.22 39.62,14.99 39.62,17.02 GO1.1
GPOUT2  (via drill 0.25)
  Top 0.254: IC2.6 36.82,14.72 36.19,14.1 34.52,14.1 v34.47,14.15
  Bottom 0.254: GO2.1 29.21,5.84 29.97,6.6 31.24,6.6 32,7.37 32,9.14 34.54,11.68 34.54,14.07 v34.47,14.15
GPOUT3  (via drill 0.25)
  Top 0.254: IC2.7 36.56,15.22 36.22,14.88 33.78,14.88 33.78,14.86 v33.6,14.68
  Bottom 0.254: GO3.1 30.73,8.76 34.04,12.06 34.04,12.95 33.27,13.72 33.27,14.35 v33.6,14.68
GPOUT4  (via drill 0.25)
  Top 0.254: IC2.8 37.37,15.72 37.34,15.75 37.34,18.8 37.85,19.3 39.62,19.3 v39.88,19.05 | GO4.1 41.5,24.74 v38.86,22.1
  Bottom 0.254: v39.88,19.05 38.86,20.07 v38.86,22.1
GPOUT5  (via drill 0.25)
  Top 0.254: IC2.9 36.55,15.85 36.32,15.62 35.81,15.62 v35.81,15.65
  Bottom 0.254: 35.81,15.62 v35.81,15.65 35.81,16.51 35.48,16.84 33.35,16.84 32.26,15.75 30.73,15.75 29.72,16.76 29.72,21.08 31.5,22.86 31.5,23.62 30.99,24.13 GO5.1
GPOUT6  (via drill 0.25)
  Top 0.254: v32.26,18.8 30.4,18.8 29.64,18.03 GO6.1 26.92,18.03 | IC2.10 36.05,18.01 36.58,18.54 v36.58,18.49
  Bottom 0.254: v36.58,18.49 36.53,18.49 36.07,18.03 33.02,18.03 v32.26,18.8
GPOUT7  (via drill 0.25)
  Top 0.254: IC2.11 35.55,18.78 35.81,19.05 35.79,19.08 v35.79,19.13
  Bottom 0.254: v35.79,19.13 35.74,19.13 34.8,20.07 GO7.1
GPX  (via drill 0.25)
  Top 0.254: IC2.17 31.7,16.82 GPX.1 | v42.93,7.11 42.93,6.86 44.96,4.83 44.96,1.78 44.45,1.27 14.99,1.27 6.86,9.4 1.52,9.4 1.02,9.91 1.02,19.05 1.52,19.56 4.44,19.56 4.7,19.3 4.7,18.31 U1.4
  Bottom 0.254: GPX.1 35.81,17.53 36.83,16.51 36.83,14.22 42.93,8.13 v42.93,7.11
LED  (via drill 0.25)
  Top 0.254: v56.39,26.16 56.39,22.86 v54.86,21.34 | v46.99,19.56 47.24,19.81 48.51,19.81 48.56,19.85 IC1.44 | R10.2 69.85,48.64 v69.18,48.01
  Bottom 0.254: v56.39,26.16 59.69,29.46 59.69,30.73 62.48,33.53 62.48,41.15 63.25,41.91 64.01,41.91 66.29,44.2 SV2.10 66.29,45.21 69.09,48.01 v69.18,48.01 | v54.86,21.34 49.53,21.34 47.75,19.56 v46.99,19.56
M1A  (via drill 0.25)
  Top 0.254: v56.64,27.94 56.64,29.56 IC1.25 | v40.64,26.16 40.64,25.15 37.34,21.84 29.21,21.84 27.18,19.81 26.16,19.81 25.15,18.8 25.15,16.87 24.64,16.36 21.62,16.36 20.07,17.91 19.13,17.91 18.44,17.22 18.44,17.12 17.58,16.26 R20.2 16.93,16.17 16.26,15.49 | M1A.1 8.13,17.78 8.13,15.24 8.38,14.99 16,14.99 16.38,15.37 | 16.38,15.37 16.51,15.49 | R41.2 16.26,15.49 | 16.26,15.49 16.38,15.37
  Bottom 0.254: v40.64,26.16 40.64,28.19 41.91,29.46 55.12,29.46 v56.64,27.94
M1B  (via drill 0.25)
  Top 0.254: R21.2 16.76,34.29 17.78,35.31 18.8,35.31 | 18.8,35.31 37.34,35.31 v41.78,30.86 | IC1.26 55.88,29.6 55.88,27.43 55.37,26.92 54.36,26.92 54.1,26.67 51.56,26.67 49.28,28.96 v49.28,30.73 | M1B.1 18.8,35.31 | R40.2 44.96,31.5 v44.7,31.24
  Bottom 0.254: v49.28,30.73 44.7,30.73 | v44.7,31.24 44.7,30.73 | 44.7,30.73 41.91,30.73 v41.78,30.86
M1CS  (via drill 0.25)
  Top 0.254: C14.1 24.55,31.75 23.37,31.75 v22.86,32.26 22.86,30.99 23.71,30.14 R18.1
  Bottom 0.254: SV4.1 25.65,27.69 22.86,30.48 v22.86,32.26
M1CS_DIS
  Top 0.254: SV4.2 28.45,33.02 27.18,34.29 22.01,34.29 R14.1
M1EN  (via drill 0.25)
  Top 0.254: v58.42,31.24 58.42,29.74 IC1.23 | 25.02,19.94 25.4,20.32 26.92,20.32 28.96,22.35 37.08,22.35 39.88,25.15 39.88,26.92 v39.9,26.92 | 25.02,19.94 24.38,19.3 24.13,19.3 23.88,19.05 | 23.62,18.99 23.62,19.05 23.88,19.05 | R16.2 23.9,19.02 23.88,19.05 | v25.02,19.81 25.02,19.94
  Bottom 0.254: v39.9,26.92 39.9,28.22 41.66,29.97 57.15,29.97 v58.42,31.24 | M1EN.1 25.78,20.57 v25.02,19.81
M2A  (via drill 0.25)
  Top 0.203: R27.2 83.31,43.94
  Top 0.254: v72.9,26.54 73.66,27.3 73.66,44.2 75.95,46.48 83.31,46.48 | 83.31,46.48 R27.2 | 83.31,46.48 86.87,46.48 87.54,45.81 R39.2 87.54,45.89 89.15,47.5 89.15,47.75 M2A.1 | IC1.42 49.67,21.48 50.55,22.35 v50.55,23.11
  Bottom 0.254: v50.55,23.11 52.07,23.11 52.58,22.61 71.88,22.61 72.9,23.62 v72.9,26.54
M2B  (via drill 0.25)
  Top 0.203: 83.4,23.62 R38.2 | R38.2 83.48,23.46 | 83.06,24.89 R28.2 83.15,24.8 83.31,24.64 83.31,23.62 83.57,23.37 R38.2
  Top 0.254: v75.44,24.13 77.72,21.84 81.03,21.84 82.55,23.37 83.57,23.37 84.58,23.37 M2B.1 | 51.56,22.1 v51.56,22.07 51.56,21.59 50.65,20.68 IC1.43
  Bottom 0.254: v75.44,24.13 74.42,24.13 72.39,22.1 51.56,22.1 v51.56,22.07
M2CS
  Top 0.254: C27.1 77.22,28.28 R25.1 77.38,27.01 SV5.1
M2CS_DIS
  Top 0.254: SV5.2 79.25,23.37 80.77,24.89 R29.1
M2EN  (via drill 0.25)
  Top 0.254: R23.2 75.18,42.93 74.68,42.42 74.68,32 v75.18,31.5 | IC1.24 57.56,31.9 58.42,32.77 64.01,32.77 v67.31,29.46
  Bottom 0.254: v67.31,29.46 72.14,29.46 | 72.14,29.46 73.15,29.46 v75.18,31.5 | M2EN.1 72.39,29.72 72.14,29.46
MAX_INT  (via drill 0.25)
  Top 0.254: IC1.21 61.11,27.08 61.47,27.43 64.01,27.43 v64.26,27.18 | 28.96,17.27 R5.1 28.96,17.02 29.21,17.02 29.72,16.51 29.72,16 30.5,15.22 IC2.18 32.82,15.22 v33.22,15.62
  Bottom 0.254: v64.26,27.18 64.52,27.43 79.25,27.43 80.52,26.16 80.52,8.89 77.22,5.59 43.31,5.59 42.16,6.73 42.16,8.2 35.05,15.32 35.05,16 34.67,16.38 33.68,16.38 33.22,15.93 v33.22,15.62
MAX_SS  (via drill 0.25)
  Top 0.254: v64.26,28.45 61.21,28.45 | 61.21,28.45 60.71,27.94 60.2,27.94 60.16,27.9 IC1.22 | 61.21,28.45 61.21,29.72 R37.2 | IC2.14 34.05,15.81 v34.24,15.62
  Bottom 0.254: v64.26,28.45 79.76,28.45 81.03,27.18 81.03,8.64 77.47,5.08 42.67,5.08 41.66,6.1 41.66,8 34.24,15.42 v34.24,15.62
MISO
  Top 0.254: IC2.15 33.55,19.83 34.54,20.83 43.43,20.83 48.51,15.75 48.51,14.22 X3.1 51.16,15.85 IC1.2
MOSI  (via drill 0.25)
  Top 0.254: IC1.1 50.36,16.57 v49.4,15.62 43.69,21.34 34.29,21.34 33.05,20.09 IC2.16
  Bottom 0.254: X3.4 47.5,12.45 50.29,12.45 51.05,13.21 51.05,13.97 v49.4,15.62
MOUT1A  (via drill 0.25)
  Top 0.254: IC5.2 10.24,19.96 10.24,22.86 | 10.24,23.01 11.82,23.01 IC5.S2 11.82,22.86 | IC5.8 13.21,22.86
  Top 0.305: IC5.8 13.22,18.45 13.74,17.93 | IC5.10 14.22,18.44 v13.74,17.96 | IC5.11 14.72,18 v14.76,17.96 15.22,18.42 IC5.12
  Top 1.676: 10.24,23.65 10.24,22.86 | 2.54,23.62 2.54,23.65 MOTOR1.1 9.88,23.65 9.91,23.62
  other vias: 13.06,23.9 13.06,22.89 13.06,21.87 12.04,21.87 11.02,21.87 10.01,21.87 8.99,21.87 8.99,22.89 8.99,23.9 10.01,23.9 11.02,23.9 12.04,23.9 12.04,22.89 11.02,22.89 10.01,22.89 14.76,16.94 14.76,15.93 13.74,15.93 13.74,16.94
  pour Top (no thermals): 8.38,24.49 13.54,24.49 13.54,21.34 8.38,21.34
  pour Bottom (no thermals): 8.38,24.49 13.54,24.49 13.54,21.34 8.38,21.34
  pour Top (no thermals): 15.27,18.77 15.27,15.44 13.18,15.44 13.18,20.8 13.28,20.8 13.28,18.8 14.17,18.8 14.17,18.77
  pour Bottom (no thermals): 13.28,19.1 13.28,15.44 15.27,15.47 15.27,20.83 13.56,20.8 13.56,21.84 8.41,21.84 8.41,19.1
MOUT1B  (via drill 0.25)
  Top 0.254: 13.23,29.82 13.23,26.42 | 12.19,26.42 11.82,26.42 IC5.S3 11.82,27.1 | IC5.35 10.24,29.82 10.24,27.1
  Top 0.305: IC5.29 13.23,29.82 13.23,31.14 13.28,31.14 13.69,31.55 13.69,31.85 | IC5.27 14.22,31.35 v13.69,31.88 | IC5.25 15.22,31.36 v14.71,31.88 14.72,31.86 IC5.26
  Top 1.676: 10.24,26.16 10.24,27.1 | 2.54,26.16 2.54,26.19 MOTOR1.2 9.62,26.19 9.65,26.16
  other vias: 13.06,25.86 13.06,26.87 13.06,27.89 12.04,27.89 11.02,27.89 10.01,27.89 8.99,27.89 8.99,26.87 8.99,25.86 10.01,25.86 10.01,26.87 11.02,26.87 12.04,26.87 12.04,25.86 11.02,25.86 13.69,33.91 14.71,33.91 14.71,32.89 13.69,32.89
  pour Top (no thermals): 8.38,28.45 13.54,28.45 13.54,25.3 8.38,25.3
  pour Bottom (no thermals): 8.38,28.45 13.54,28.45 13.54,25.3 8.38,25.3
  pour Top (no thermals): 13.18,28.98 13.18,34.47 15.27,34.47 15.27,31.01 14.17,31.01 14.17,30.99 13.28,30.99 13.28,28.98
  pour Bottom (no thermals): 13.28,30.68 13.28,34.47 15.09,34.47 15.09,28.98 13.56,28.98 13.56,27.94 8.41,27.94 8.41,30.68
MOUT2A  (via drill 0.25)
  Top 0.254: IC6.8 86.87,39.98 86.87,36.58 88.39,36.58 88.39,36.83 88.33,36.77 88.33,36.7 | IC6.2 89.86,36.77 89.79,36.7 88.33,36.7 | 88.33,36.7 IC6.S2
  Top 0.305: IC6.8 86.86,41.29 v86.31,41.83 85.86,41.38 IC6.10 | IC6.11 85.36,41.77 v85.29,41.83 84.86,41.4 IC6.12
  Top 1.676: 89.86,36.77 89.86,36.35 MOTOR2.1 97.54,36.35 97.54,36.32
  other vias: 87.02,36.04 87.02,37.06 88.04,36.04 89.05,36.04 90.07,36.04 91.08,36.04 87.02,38.07 88.04,38.07 89.05,38.07 90.07,38.07 91.08,38.07 91.08,37.06 90.07,37.06 89.05,37.06 88.04,37.06 86.31,42.85 86.31,43.87 85.29,43.87 85.29,42.85
  pour Top (no thermals): 86.51,38.61 91.67,38.61 91.67,35.46 86.51,35.46
  pour Bottom (no thermals): 86.51,38.61 91.67,38.61 91.67,35.46 86.51,35.46
  pour Top (no thermals): 84.81,41.15 84.81,44.5 86.89,44.5 86.89,39.14 86.82,39.14 86.82,41.15
  pour Bottom (no thermals): 86.82,40.72 86.82,44.5 84.81,44.5 84.81,39.24 86.51,39.24 86.51,35.56 91.67,35.56 91.67,40.72
MOUT2B  (via drill 0.25)
  Top 0.254: IC6.29 86.86,33.26 | 87.12,33.53 88.21,33.53 IC6.S3 88.31,33.53 89.66,33.53 89.86,33.33 IC6.35
  Top 0.305: IC6.29 86.86,28.66 86.36,28.17 | IC6.27 85.86,28.65 v86.33,28.17 | IC6.25 84.86,28.63 v85.32,28.17 85.36,28.21 IC6.26
  Top 1.676: 89.86,33.33 89.86,33.81 MOTOR2.2 97.54,33.81 97.54,33.78
  other vias: 87.02,34.09 88.04,34.09 89.05,34.09 90.07,34.09 91.08,34.09 87.02,33.07 87.02,32.05 88.04,32.05 89.05,32.05 90.07,32.05 91.08,32.05 91.08,33.07 90.07,33.07 89.05,33.07 88.04,33.07 85.32,27.15 85.32,26.14 86.33,26.14 86.33,27.15
  pour Top (no thermals): 86.51,34.65 91.67,34.65 91.67,31.5 86.51,31.5
  pour Bottom (no thermals): 86.51,34.65 91.67,34.65 91.67,31.5 86.51,31.5
  pour Top (no thermals): 86.92,30.96 86.92,25.6 84.81,25.6 84.81,28.96 85.9,28.96 85.9,28.85 86.82,28.85 86.82,30.96
  pour Bottom (no thermals): 86.79,29.51 86.79,25.6 84.81,25.6 84.81,30.86 86.51,30.86 86.51,34.54 91.67,34.54 91.67,29.51
N$1
  Top 0.254: C3.2 61.98,10.92 61.91,10.92 RESET_EN.1 61.09,10.92
N$2
  Top 0.254: IC1.8 55.96,8.31 56.9,7.37 C2.1 56.81,3.47 56.64,3.3 Q1.1
N$3
  Top 0.254: IC1.7 55.16,7.42 C1.2 55.21,6.69 51.82,3.3 Q1.2
N$4
  Top 0.61: Q4.3 71.37,50.02 D2.A 72.92,51.56 77.22,51.56 77.88,50.9 77.88,50.93 SG1.-
N$5
  Top 0.254: R11.1 72.22,42 JP1.2
N$6
  Top 0.254: X4.2 82.65,14.89 81.79,15.75 73.66,15.75 73.15,16.26 70.87,16.26 70.61,16 R33.1
N$7
  Top 0.254: LED.A R10.1
N$8
  Top 0.254: 6.86,14.6 OL.A 6.86,14.73 | 6.86,14.6 6.86,14.48 | R42.1 9.4,13.97 9.14,14.22 7.24,14.22 6.86,14.6
N$9
  Top 0.254: R2.1 PWR.A
N$10
  Top 0.254: X4.3 82.63,12.87 80.26,15.24 72.22,15.24 R32.1
N$11
  Top 0.254: IC9.7 71.05,13.19 R33.2
N$12
  Top 0.254: U1.3 5.75,15.69 OL.C
N$14
  Top 0.254: 28.79,15.66 28.7,15.75 | IC2.20 30.74,14.22 29.72,15.24 29.3,15.24 R7.2 28.79,15.66 | 28.79,15.66 28.83,15.62
N$16
  Top 0.254: IC2.21 29.29,13.72 R6.2
N$17
  Top 0.254: X5.3 18.67,12.9 18.67,13.84 19.61,14.78 26.53,14.78 R6.1
N$18
  Top 0.254: R7.1 27.09,15.91 | R7.1 27.05,15.75 26.57,15.27 18.06,15.27 16.76,13.97 16.76,12.93 X5.2 | R7.1 27.18,15.75
N$19
  Top 0.254: IC2.25 33.05,7.85 34.04,6.86 | 34.04,6.86 34.04,5.84 36.58,3.3 Q2.2 | 34.04,6.86 34.29,6.6 C17.2
N$20
  Top 0.254: 31.34,12.22 31.35,12.22 IC2.24 32.33,12.22 32.35,12.21 32.35,6.86 C16.2 32.6,3.47 32.77,3.3 Q2.1
N$21
  Top 0.254: IC3.12 36.67,27.85 37.59,26.92 37.57,26.92 INT.1
N$22
  Top 0.254: IC3.20 34.56,33.66 C22.1
N$23
  Top 0.254: IC3.10 34.06,26.99 C23.2
N$24
  Top 0.254: R23.1 R13.1 78.49,41.4 81.28,38.61 | IC6.21 82.86,31.27 82.63,31.5 82.04,31.5 81.28,32.26 81.28,38.61 | IC6.16 82.86,38.91 82.55,38.61 81.28,38.61
N$25
  Top 0.254: R25.2 79.08,30.23 | 79.08,30.23 R24.2 | IC6.19 79.19,30.12 79.08,30.23
N$26
  Top 0.254: IC5.16 17.22,21.03 17.53,21.34 18.29,21.34 18.54,21.59 | 18.54,21.59 18.54,27.94 18.03,28.45 17.53,28.45 17.22,28.75 IC5.21 | 18.54,21.59 20.07,21.59 20.57,21.08 20.57,19.56 22.35,17.78 R15.1 | 22.1,17.78 22,17.88 22.3,17.88 22.3,17.82 R15.1 | R15.1 23.39,17.77 R16.1
N$27
  Top 0.254: R11.2 70.52,46.57 70.36,46.74 70.37,46.75 Q4.1
N$29
  Top 0.254: IC5.19 22.01,29.82 R18.2 21.88,30.06 22.48,29.46 24.55,29.46 R17.2
N$30
  Top 0.254: IC5.20 17.72,30.93 18.03,31.24 19.22,31.24 R12.1 20.32,30.9 R14.2 21.34,31.75
N$31
  Top 0.254: IC5.22 16.72,31.62 R21.1
N$32
  Top 0.254: IC5.15 16.72,18.94 17.42,18.24 17.53,18.24 | 17.53,18.24 17.66,18.24 | R20.1 17.58,18.19 17.53,18.24
N$33
  Top 0.254: IC5.17 17.72,18.96 17.93,18.75 18.73,18.75 18.73,19.53 R19.1
N$34
  Top 0.254: IC6.22 83.36,26.71 83.06,26.42 R28.1
N$35
  Top 0.254: IC6.15 83.36,42.29 R27.1
N$36
  Top 0.254: IC6.17 82.36,41.51 R26.1
N$37
  Top 0.254: IC6.20 82.36,28.09 R29.2 80.77,26.49 81.61,25.65 83.85,25.65 84.66,24.84 87.51,24.84 R22.1
N$40
  Top 0.61: F2.1 85.67,14.35 X4.1
N$41
  Top 0.254: IC9.15 71.7,6.88 R8.2
N$42
  Top 0.254: IC9.2 73.59,9.84 74.42,10.67 75.1,10.67 R9.2
N$43
  Top 0.254: IC9.6 71.7,13.19 R32.2
N$45
  Top 0.254: IC9.8 IC9.9 68.66,11.14 C30.2
N$48
  Top 0.254: RX.A 65.53,13.21 64.77,13.97 64.77,17.53 65.28,18.03 R3.1
N$49
  Top 0.254: R4.1 66.21,14.93 TX.A
PWM1A  (via drill 0.25)
  Top 0.254: v32.51,21.08 32.26,21.08 32,21.34 29.41,21.34 27.38,19.3 26.42,19.3 25.65,18.54 25.65,16.61 24.89,15.85 19.96,15.85 19.61,16.21 PWM1A.1 | IC1.14 61.33,21.48 62.99,19.81 v63.5,19.81 | 20.07,18.54 19.88,18.54 R19.2 20.36,18.76 20.83,18.29 v20.83,18.19
  Bottom 0.254: v32.51,21.08 36.07,21.08 37.34,19.81 37.34,16 38.35,14.99 40.13,14.99 41.15,13.97 41.15,11.43 43.18,9.4 61.21,9.4 63.5,11.68 v63.5,19.81 | PWM1A.1 19.61,16.97 v20.83,18.19
PWM1B  (via drill 0.25)
  Top 0.254: v74.68,23.24 74.68,23.11 74.17,23.62 74.17,43.94 75.18,44.96 PWM1B.1 80.52,44.96 81.53,43.94 R26.2 | IC1.13 58.83,20.68 v58.42,21.08
  Bottom 0.254: v58.42,21.08 58.93,21.59 73.02,21.59 v74.68,23.24
PWM2A  (via drill 0.25)
  Top 0.254: v68.33,23.37 67.31,22.35 62.23,22.35 61.47,23.11 60.19,23.11 IC1.16 | v68.83,26.42 68.58,26.67 68.58,41.4 67.56,42.42 65.28,42.42 63.75,43.94 SV2.9
  Bottom 0.254: v68.33,23.37 68.83,23.88 v68.83,26.42
PWM2B  (via drill 0.25)
  Top 0.254: IC1.15 61.54,22.28 61.98,21.84 68.07,21.84 69.34,23.11 69.34,23.62 68.83,24.13 67.56,24.13 v67.06,23.62 | v67.31,26.67 68.07,27.43 68.07,41.15 67.56,41.66 63.25,41.66 61.21,43.69 SV2.8
  Bottom 0.254: v67.06,23.62 67.31,23.88 v67.31,26.67
RESET  (via drill 0.25)
  Top 0.254: RESET_EN.2 61.06,11.84 v59.94,12.95 | 55.63,48.77 50.55,48.77 48.51,46.74 SV2.3 48.51,43.94 46.74,42.16 45.97,42.16 44.7,40.89 v44.7,35.81 | 55.63,48.77 58.17,48.77 59.78,50.38 S1.B2 | IC2.12 35.05,19.55 35.36,19.86 42.98,19.86 45.85,16.99 45.85,15.62 X3.5 | IC1.4 v52.76,19.71 | 52.76,19.81 v52.76,19.71 | v52.76,19.71 | D3.A 55.66,50.72 R1.1 55.71,48.86 55.63,48.77
  Bottom 0.254: v59.94,12.95 59.94,11.68 58.93,10.67 57.15,10.67 55.63,12.19 55.63,17.02 52.83,19.81 52.83,19.79 v52.76,19.71 52.73,19.71 52.7,19.68 50.04,19.68 46.99,16.64 | v44.7,35.81 43.94,35.81 40.89,32.77 36.32,32.77 34.54,30.99 34.54,25.4 36.07,23.88 39.75,23.88 46.99,16.64 | 44.2,13.97 X3.5 44.07,13.72 46.99,16.64
RTS
  Top 0.254: IC9.16 72.35,8.42 73.66,7.11 73.66,4.57 70.61,1.52 64.9,1.52 62.36,4.06 62.36,6.77 C3.1
RXD0  (via drill 0.25)
  Top 0.254: 56.85,18.08 56.64,18.29 | IC1.9 56.85,18.08 | 56.85,18.08 56.9,18.03 56.77,17.91 56.77,16.64 59.18,14.22 60.96,14.22 63.25,11.94 v63.25,4.32 63.25,3.94 64.9,2.29 70.36,2.29 71.88,3.81 R8.1 72.3,4.99
  Bottom 0.254: v63.25,4.32 62.99,4.57 30.23,4.57 29.97,4.32 28.7,4.32 27.94,5.08 27.94,6.6 29.46,8.13 29.46,13.72 24.08,19.1 24.08,22.35 27.13,25.4 29.97,25.4 32,27.43 32,30.73 35.56,34.29 39.88,34.29 42.93,37.34 43.94,37.34 44.7,38.1 44.7,40.89 45.97,42.16 49.53,42.16 51.05,43.69 SV2.4
RXD1  (via drill 0.25)
  Top 0.254: SV2.6 56.13,45.21 58.42,47.5 66.8,47.5 68.83,45.47 68.83,42.93 69.6,42.16 69.6,28.7 71.37,26.92 v71.37,26.54 | IC1.11 64.3,18.08 66.29,20.07 69.09,20.07 71.37,22.35 v71.37,23.62
  Bottom 0.254: v71.37,23.62 v71.37,26.54
RXLED
  Top 0.254: IC9.11 69.14,9.84 68.58,9.27 68.58,4.32 67.56,3.3 66.29,3.3 64.77,4.83 64.77,11.18 65.79,12.19 67.82,12.19 68.07,12.45 68.07,13.21 RX.C
SCK  (via drill 0.25)
  Top 0.254: IC2.13 34.54,20.07 34.8,20.32 43.18,20.32 46.48,17.02 X3.3 | v51.97,16.59 51.97,18.06 IC1.3
  Bottom 0.254: v51.97,16.59 49.1,16.59 X3.3
SCL  (via drill 0.25)
  Top 0.254: IC3.23 33.02,34.04 33.27,34.29 36.83,34.29 39.88,31.24 39.88,30.23 41.4,28.7 v42.42,28.7 42.8,28.32 42.8,27.55 R30.1 | IC1.19 61.04,25.48 v61.98,26.42
  Bottom 0.254: SV1.10 66.29,32.26 62.99,28.96 62.99,27.43 v61.98,26.42 61.98,25.4 60.83,24.26 52.7,24.26 50.55,26.42 44.7,26.42 v42.42,28.7
SDA  (via drill 0.25)
  Top 0.254: IC3.24 32.52,34.29 33.02,34.8 37.08,34.8 40.39,31.5 40.39,30.73 41.4,29.72 42.93,29.72 v43.94,28.7 43.94,28.19 44.2,27.94 R31.1 | v58.17,25.65 58.8,26.29 60.14,26.29 IC1.20
  Bottom 0.254: SV1.9 63.75,31.24 v58.17,25.65 57.28,24.76 53.72,24.76 51.05,27.43 45.21,27.43 v43.94,28.7
TXD0  (via drill 0.25)
  Top 0.254: v57.79,13.08 57.79,11.56 60.96,8.38 60.96,5.59 61.59,4.95 v61.59,3.81 64.39,1.02 71.37,1.02 75.18,4.83 R9.1 | IC1.10 57.56,20.02 v57.53,20.04
  Bottom 0.254: v61.59,3.81 28.45,3.81 27.43,4.83 27.43,6.86 28.96,8.38 28.96,13.46 23.62,18.8 23.62,22.61 26.92,25.91 29.72,25.91 31.5,27.69 31.5,30.99 35.31,34.8 39.62,34.8 41.91,37.08 41.91,41.15 43.43,42.67 49.28,42.67 49.78,43.18 49.78,46.23 50.55,46.99 52.58,46.99 53.59,45.97 SV2.5 | v57.79,13.08 57.79,19.94 57.66,20.07 57.63,20.04 v57.53,20.04
TXD1  (via drill 0.25)
  Top 0.254: SV2.7 58.67,44.96 60.71,46.99 66.55,46.99 68.07,45.47 68.07,42.67 69.09,41.66 69.09,27.56 v70.1,26.54 | IC1.12 60.64,19.88 61.98,18.54 64.01,18.54 66.29,20.83 68.83,20.83 70.1,22.1 v70.1,23.62
  Bottom 0.254: v70.1,23.62 v70.1,26.54
TXLED
  Top 0.254: TX.C 68.33,14.73 68.58,14.48 72.9,14.48 73.15,14.22 73.15,12.69 IC9.5
VBAT  (via drill 0.25)
  Top 0.254: v43.69,32.13 38.23,37.59 36.83,37.59 36.07,38.35 36.07,41.15 33.53,43.69 24.89,43.69 R35.1 R36.2 C34.2 | IC1.32 51.16,31.39 v50.8,31.75
  Bottom 0.254: v43.69,32.13 43.94,32.13 44.45,32.64 46.86,32.64 48.51,34.29 50.8,34.29 51.56,33.53 51.56,32.51 v50.8,31.75
VBUS  (via drill 0.25)
  Top 0.254: IC9.10 69.03,10.48 67.44,8.89 67.31,8.89
  Top 0.406: v67.31,10.16 67.31,9.4 | 67.31,9.4 67.31,8.89 C12.1 | C13.2 67.22,9.49 67.31,9.4 | F2.2 93.93,17.15 D1.A
  Top 0.61: R4.2 67.91,17.27 | 67.91,17.27 67.91,17.95 67.82,18.03 R3.2 68.07,18.03 | 67.91,17.27 68.03,17.15 v69.21,17.15 F2.2
  Bottom 0.406: v69.21,17.15 69.21,12.06 v67.31,10.16
VBUS_HOST
  Top 0.61: U1.1 2.78,14.77 2.02,14.01 C18.1 2.02,11.76 C19.1 | C19.1 2.03,11.68 2.08,11.63 2.08,11.2 2.9,10.39 7.39,10.39 10.92,6.86 13.21,6.86 14.22,7.87 14.22,12.85 X5.1 | 2.03,11.75 C19.1
VCC  (via drill 0.25)
  Top 0.254: IC6.13 84.36,34.94 | IC6.24 84.36,34.14 | IC5.24 15.72,27.43 14.99,27.43 | IC5.13 15.72,22.35 16.15,22.35 v16.15,22.38
  Top 0.61: v19.56,26.42 v19.56,25.4 v19.56,24.38 22.61,24.38 C11.+ 22.61,23.11 21.5,22.01 C32.1 | C25.1 77.81,37.43 | 77.81,37.43 77.72,37.34 C20.+ | 77.81,37.43 77.81,36.74 78.99,35.56 v80.26,35.56 | v80.26,35.56 v80.26,36.58 | v80.26,35.56 v80.26,34.54
  Top 0.813: 17.2,25.4 v17.17,25.43 | 82.93,34.54 v82.96,34.57
  other vias: 15.14,27.46 17.17,27.46 15.14,26.44 15.14,25.43 15.14,24.41 15.14,23.39 16.15,26.44 17.17,26.44 16.15,25.43 16.15,24.41 17.17,24.41 16.15,23.39 17.17,23.39 15.14,22.38 17.17,22.38 82.96,32.54 82.96,33.55 83.97,32.54 83.97,33.55 83.97,34.57 84.99,32.54 84.99,33.55 84.99,34.57 84.99,35.59 84.99,36.6 84.99,37.62 83.97,37.62 83.97,35.59 83.97,36.6 82.96,37.62 82.96,36.6 82.96,35.59 16.15,27.46 19.81,56.39 19.81,55.37 19.81,54.36 20.83,54.36 21.84,54.36 22.86,54.36 22.86,55.37 21.84,55.37 20.83,55.37 20.83,56.39 21.84,56.39 22.86,56.39 24.38,46.99 25.4,46.99 26.42,46.99 27.43,46.99 27.43,48.01 26.42,48.01 25.4,48.01 24.38,48.01 23.88,54.36 23.88,55.37 23.88,56.39 23.37,48.01 23.37,46.99 24.89,56.39 25.91,56.39 26.92,56.39 27.94,56.39 28.96,56.39 29.97,56.39 24.89,55.37 24.89,54.36 25.91,54.36 26.92,54.36 27.94,54.36 28.96,54.36 29.97,55.37 28.96,55.37 27.94,55.37 26.92,55.37 25.91,55.37 23.37,49.02 24.38,49.02 25.4,49.02 26.42,49.02 27.43,49.02
  pour Bottom (isolate 0.406, no thermals): 14.35,21.59 14.35,28.19 15.75,28.19 15.75,49.28 19.3,49.28 19.3,56.95 83.82,56.95 83.82,38.25 85.7,38.25 85.7,31.9 79.88,31.9 79.86,52.68 30.53,52.68 30.53,41.15 23.88,41.15 20.07,37.34 20.07,21.59
  pour Top (no thermals): 14.35,27.94 17.88,27.94 17.88,21.84 14.35,21.84
  pour Top (no thermals): 82.22,38.13 85.7,38.13 85.7,32.08 82.22,32.08
  pour Top (isolate 0.406, no thermals): 19.3,46.48 19.3,56.9 30.48,56.9 30.48,51.31 27.94,51.31 27.94,46.48
VCC_INT
  Top 0.254: 26.34,51.79 26.44,51.79 S4.1
  Top 0.406: 33.28,56.38 IC4.3 33.15,56.23 33.15,55.63 33.15,55.58
  Top 0.61: 25.11,45.17 29.17,45.17 29.72,45.72 29.72,46.23 29.46,46.48 C8.+
  Top 0.813: C4.2 R35.2 25.11,45.17
  Top 1.27: 26.34,51.79 29.08,51.79 | 29.08,51.79 29.08,51.82 29.21,51.82 | 29.21,51.82 29.34,51.82 | 29.34,51.82 33.15,55.63 | 29.08,51.79 29.21,51.79 29.21,51.82 | 29.34,51.82 C8.+
VDD
  Top 1.93: SV3.1 10.16,48.01 Q3.4
  pour Top (no thermals): 0.51,44.96 0.51,49.28 16.26,49.28 16.26,42.16 9.91,42.16 9.91,44.96

## Text on the board
tPlace: + | + | BALANBOT | + | V2.0 | todo: change the encoder line order of usb side.
bPlace: BALANBOT | WWW.DUINOPEAK.COM
tNames: OFF | ON | RST | VIN | RX0 | TX0 | RX1 | TX1 | ~ | ~ | ~ | - | + | 3.3V | GND | RST | 0 | 1 | 2 | 3 | 4 | 5 | 6 | WHT | +5V | GND | A0 | A1 | A2 | A3 | A4 | AREF | SDA | SCL | RED | IC3 | RED | WHT
bNames: + | - | WHT | RED | M2A | E1B | M2B | E1A | GND | +3V3 | +3V3 | GND | E2A | M1B | E2B | M1A | RED | WHT